# EAGLE design zasilacz (EAGLE 9.6.2)
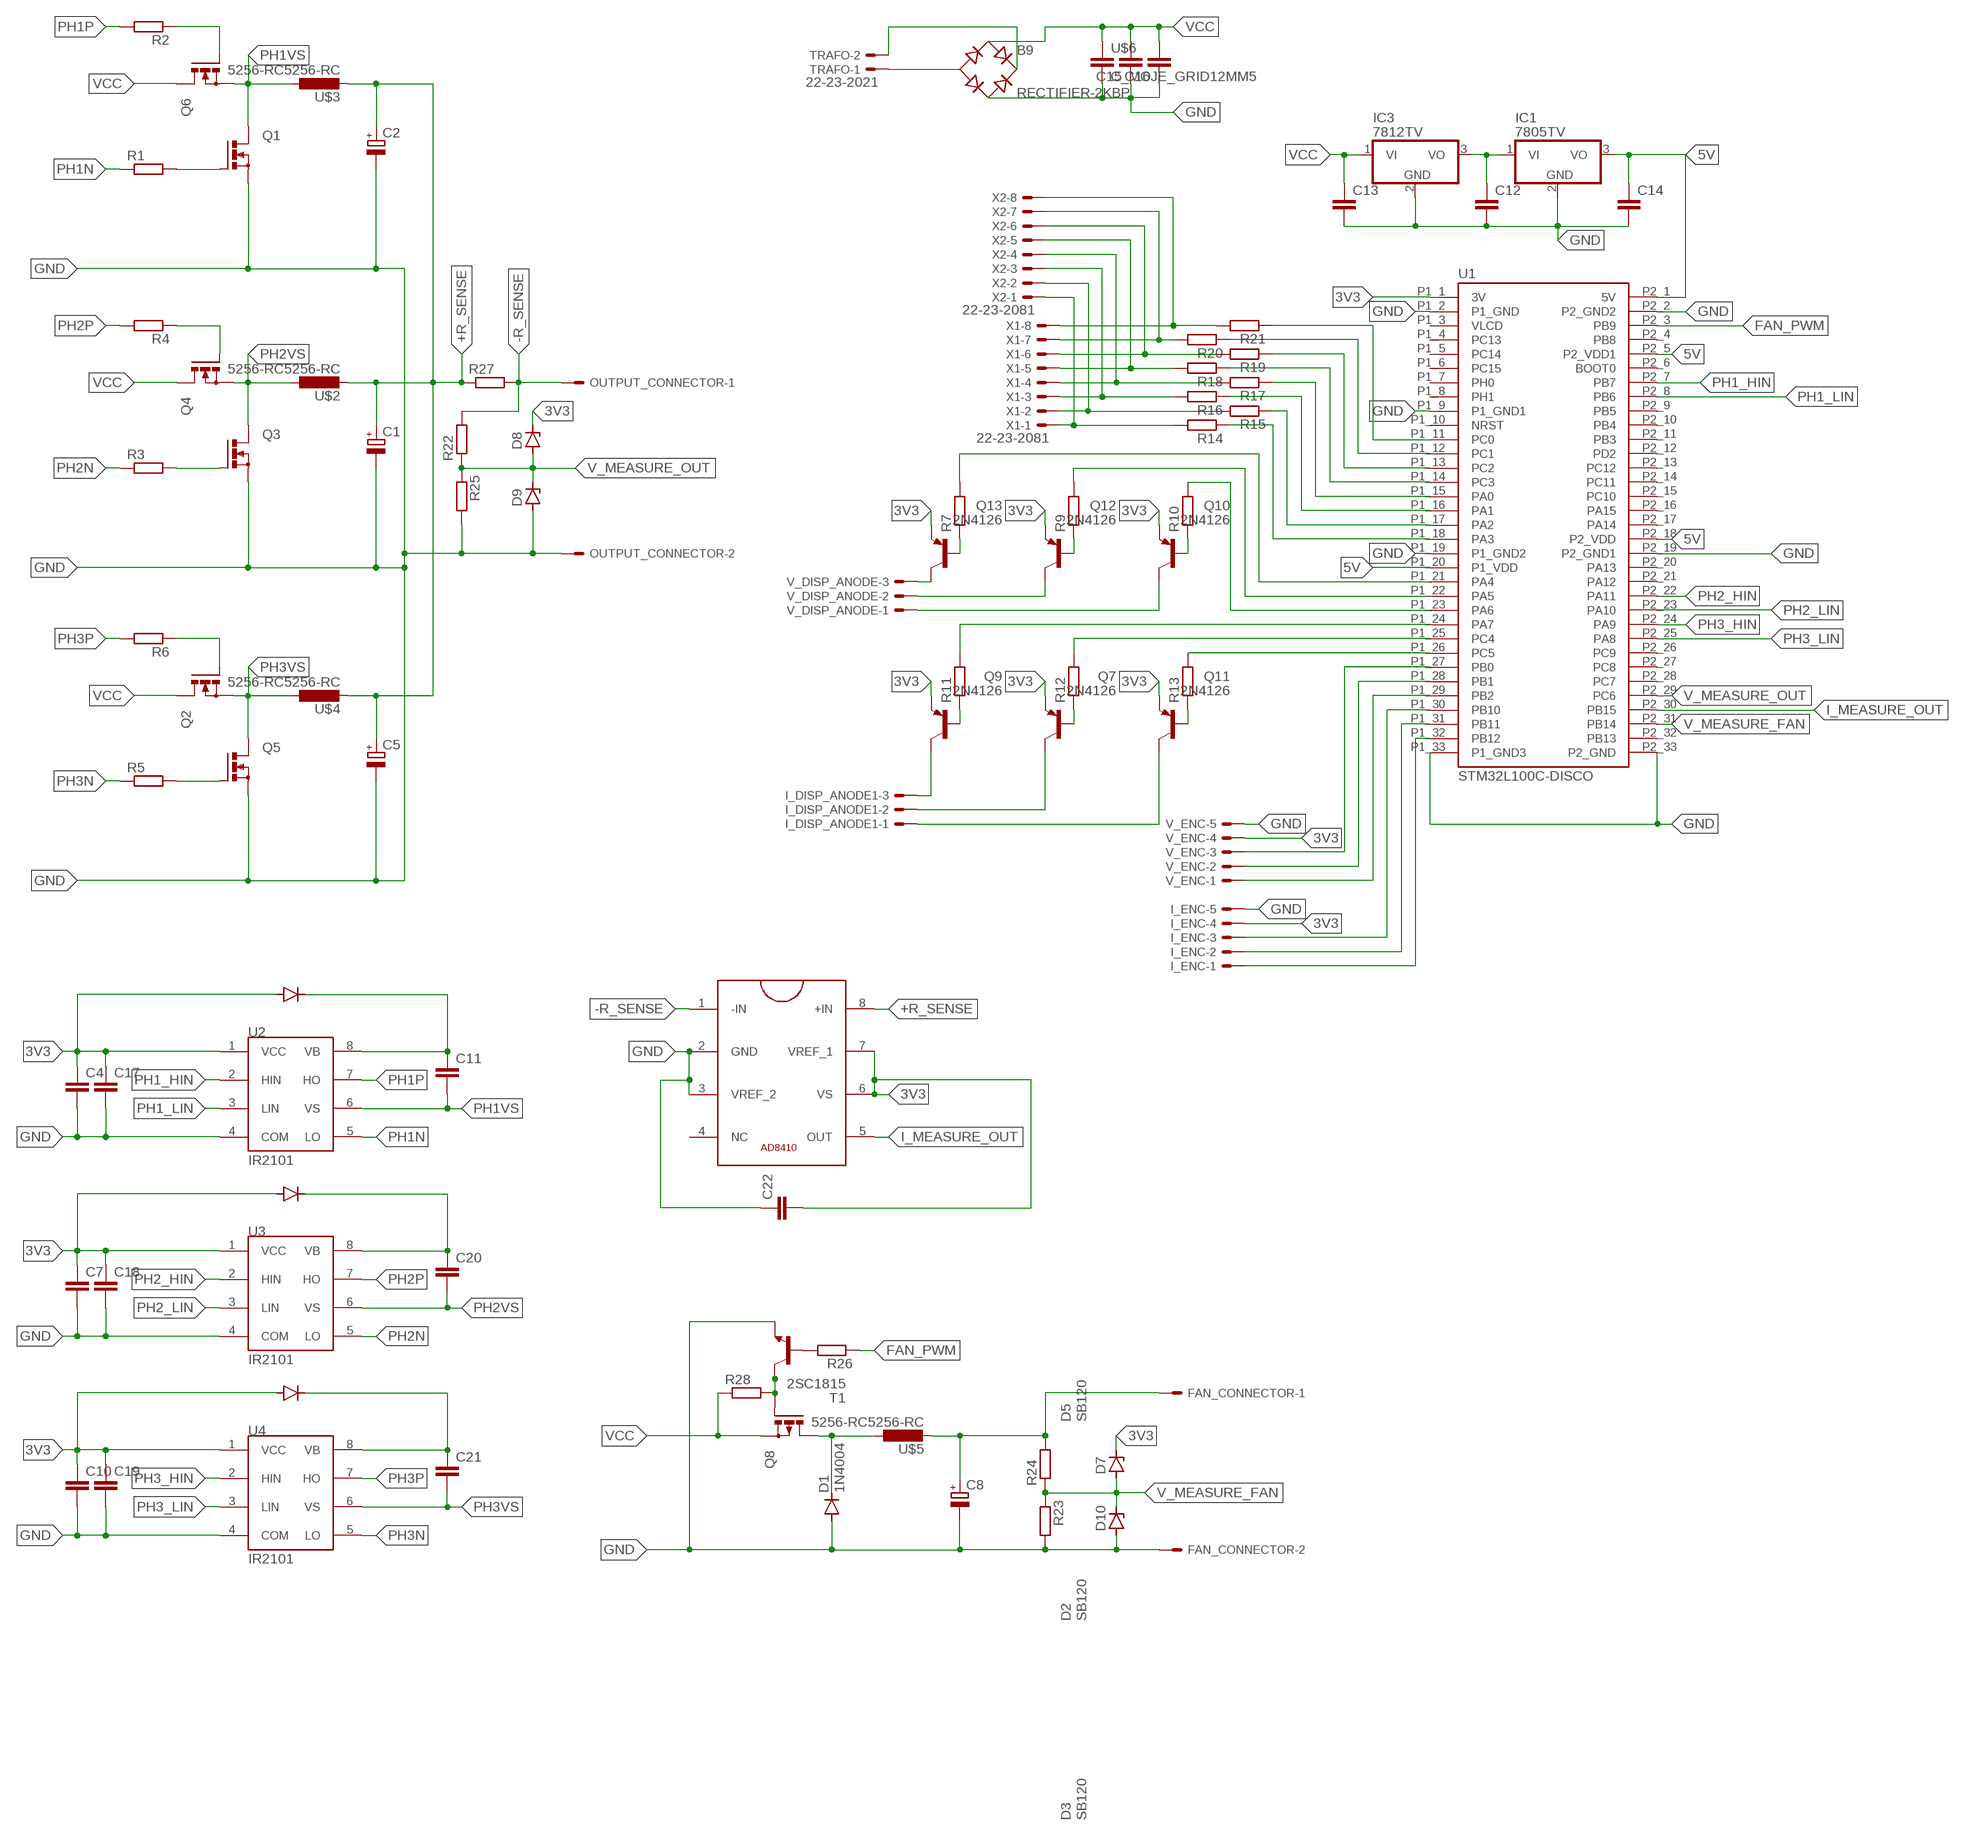
[diagram p0: schematic, sheet 1]

## Parts
B9  RECTIFIER-2KBP  [2KBP]
C1  CPOL-EUE5-13  [E5-13]
C2  CPOL-EUE5-13  [E5-13]
C4  C-EU025-024X044  [C025-024X044]
C5  CPOL-EUE5-13  [E5-13]
C7  C-EU025-024X044  [C025-024X044]
C8  CPOL-EUE5-13  [E5-13]
C10  C-EU025-024X044  [C025-024X044]
C11  C-EUC0603K  [C0603K]
C12  C-EU025-024X044  [C025-024X044]
C13  C-EU025-024X044  [C025-024X044]
C14  C-EU025-024X044  [C025-024X044]
C15  C-EU025-024X044  [C025-024X044]
C16  C-EU025-024X044  [C025-024X044]
C17  C-EU025-024X044  [C025-024X044]
C18  C-EU025-024X044  [C025-024X044]
C19  C-EU025-024X044  [C025-024X044]
C20  C-EUC0603K  [C0603K]
C21  C-EUC0603K  [C0603K]
C22  C-EU025-024X044  [C025-024X044]
D1  1N4004  [DO41-10]
D2  SB120  [DO41-10]
D3  SB120  [DO41-10]
D5  SB120  [DO41-10]
D7  ZENER-DIODEDO34-7  [DO34Z7]
D8  ZENER-DIODEDO34-7  [DO34Z7]
D9  ZENER-DIODEDO34-7  [DO34Z7]
D10  ZENER-DIODEDO34-7  [DO34Z7]
FAN_CONNECTOR  22-23-2021  [22-23-2021]
I_DISP_ANODE1  22-23-2031  [22-23-2031]
I_ENC  22-23-2051  [22-23-2051]
IC1  7805TV  [TO220V]
IC3  7812TV  [TO220V]
OUTPUT_CONNECTOR  22-23-2021  [22-23-2021]
Q1  PMOSFET_NTO220BV  [TO220BV]
Q2  PMOSFET_NTO220BV  [TO220BV]
Q3  PMOSFET_NTO220BV  [TO220BV]
Q4  PMOSFET_NTO220BV  [TO220BV]
Q5  PMOSFET_NTO220BV  [TO220BV]
Q6  PMOSFET_NTO220BV  [TO220BV]
Q7  2N4126  [TO92-CBE]
Q8  PMOSFET_PTO220BV  [TO220BV]
Q9  2N4126  [TO92-CBE]
Q10  2N4126  [TO92-CBE]
Q11  2N4126  [TO92-CBE]
Q12  2N4126  [TO92-CBE]
Q13  2N4126  [TO92-CBE]
R1  R-EU_0309/10  [0309/10]
R2  R-EU_0309/10  [0309/10]
R3  R-EU_0309/10  [0309/10]
R4  R-EU_0309/10  [0309/10]
R5  R-EU_0309/10  [0309/10]
R6  R-EU_0309/10  [0309/10]
R7  R-EU_0309/10  [0309/10]
R9  R-EU_0309/10  [0309/10]
R10  R-EU_0309/10  [0309/10]
R11  R-EU_0309/10  [0309/10]
R12  R-EU_0309/10  [0309/10]
R13  R-EU_0309/10  [0309/10]
R14  R-EU_0309/10  [0309/10]
R15  R-EU_0309/10  [0309/10]
R16  R-EU_0309/10  [0309/10]
R17  R-EU_0309/10  [0309/10]
R18  R-EU_0309/10  [0309/10]
R19  R-EU_0309/10  [0309/10]
R20  R-EU_0309/10  [0309/10]
R21  R-EU_0309/10  [0309/10]
R22  R-EU_0207/12  [0207/12]
R23  R-EU_0309/10  [0309/10]
R24  R-EU_0207/12  [0207/12]
R25  R-EU_0309/10  [0309/10]
R26  R-EU_0309/10  [0309/10]
R27  R-EU_R2512  [R2512]
R28  R-EU_0207/10  [0207/10]
T1  2SC1815  [TO92-ECB]
TRAFO  22-23-2021  [22-23-2021]
U1  STM32L100C-DISCO  [DEV_STM32L100C-DISCO]
U2  IR2101  [DIL08]
U3  IR2101  [DIL08]
U4  IR2101  [DIL08]
U$1  AD8410AD8410_V1  [AD8410]
U$2  5256-RC5256-RC  [INDAD4030W90L3300D1350B]
U$3  5256-RC5256-RC  [INDAD4030W90L3300D1350B]
U$4  5256-RC5256-RC  [INDAD4030W90L3300D1350B]
U$5  5256-RC5256-RC  [INDAD4030W90L3300D1350B]
U$6  C_MOJE_GRID12MM5  [C025-030X050]
V_DISP_ANODE  22-23-2031  [22-23-2031]
V_ENC  22-23-2051  [22-23-2051]
X1  22-23-2081  [22-23-2081]
X2  22-23-2081  [22-23-2081]

## Nets
3V3: C4.1 C7.1 C10.1 C17.1 C18.1 C19.1 D2.A D3.A D5.A D7.C D8.C I_ENC.4 Q7.E Q9.E Q10.E Q11.E Q12.E Q13.E U1.P1_1(3V) U2.1(VCC) U3.1(VCC) U4.1(VCC) V_ENC.4
5V: C14.1 IC1.3(VO) U1.P1_20(P1_VDD) U1.P2_1(5V) U1.P2_5(P2_VDD1) U1.P2_18(P2_VDD)
+R_SENSE: C1.+ C2.+ C5.+ R27.1 U$1.8(+IN) U$2.2 U$3.2 U$4.2
-R_SENSE: OUTPUT_CONNECTOR.1 R22.2 R27.2 U$1.1(-IN)
FAN_PWM: R26.1 U1.P2_3(PB9)
GND: B9.AC2 C1.- C2.- C4.2 C5.- C7.2 C8.- C10.2 C12.2 C13.2 C14.2 C15.1 C16.1 C17.2 C18.2 C19.2 C22.1 D1.A D9.A D10.A FAN_CONNECTOR.2 I_ENC.5 IC1.2(GND) IC3.2(GND) OUTPUT_CONNECTOR.2 Q1.S Q3.S Q5.S R23.2 R25.2 T1.E U1.P1_2(P1_GND) U1.P1_9(P1_GND1) U1.P1_19(P1_GND2) U1.P1_33(P1_GND3) U1.P2_2(P2_GND2) U1.P2_19(P2_GND1) U1.P2_33(P2_GND) U2.4(COM) U3.4(COM) U4.4(COM) U$1.2(GND) U$1.3(VREF_2) U$6.2 V_ENC.5
I_MEASURE_OUT: U1.P2_30(PB15) U$1.5(OUT)
N$1: Q8.G R28.2 T1.C
N$2: R26.2 T1.B
N$3: Q3.G R3.2
N$4: Q4.G R4.1
N$5: R14.1 U1.P1_18(PA3)
N$7: R15.1 U1.P1_17(PA2)
N$8: Q1.G R1.2
N$9: C22.2 U$1.6(VS) U$1.7(VREF_1)
N$10: C12.1 IC1.1(VI) IC3.3(VO)
N$11: Q6.G R2.1
N$14: R16.1 U1.P1_16(PA1)
N$16: R17.1 U1.P1_15(PA0)
N$17: R18.1 U1.P1_14(PC3)
N$18: Q5.G R5.2
N$19: Q2.G R6.1
N$20: R19.1 U1.P1_13(PC2)
N$21: Q13.C V_DISP_ANODE.3
N$22: R20.1 U1.P1_12(PC1)
N$23: B9.+ TRAFO.2
N$24: Q10.B R10.1
N$25: R21.1 U1.P1_11(PC0)
N$26: Q12.B R9.1
N$27: B9.- TRAFO.1
N$28: I_ENC.1 U1.P1_32(PB12)
N$29: D1.C Q8.D U$5.1
N$30: Q13.B R7.1
N$32: Q12.C V_DISP_ANODE.2
N$37: Q10.C V_DISP_ANODE.1
N$41: Q11.B R13.1
N$42: I_DISP_ANODE1.3 Q9.C
N$43: I_DISP_ANODE1.2 Q7.C
N$44: I_DISP_ANODE1.1 Q11.C
N$45: Q7.B R12.1
N$46: Q9.B R11.1
N$47: R14.2 X1.1 X2.1
N$48: R15.2 X1.2 X2.2
N$49: R16.2 X1.3 X2.3
N$50: R17.2 X1.4 X2.4
N$51: R18.2 X1.5 X2.5
N$52: R19.2 X1.6 X2.6
N$53: R20.2 X1.7 X2.7
N$54: R21.2 X1.8 X2.8
N$55: I_ENC.2 U1.P1_31(PB11)
N$56: I_ENC.3 U1.P1_30(PB10)
N$57: U1.P1_29(PB2) V_ENC.1
N$58: U1.P1_28(PB1) V_ENC.2
N$59: U1.P1_27(PB0) V_ENC.3
N$62: R13.2 U1.P1_26(PC5)
N$63: R12.2 U1.P1_25(PC4)
N$64: R11.2 U1.P1_24(PA7)
N$65: R10.2 U1.P1_23(PA6)
N$66: R9.2 U1.P1_22(PA5)
N$67: R7.2 U1.P1_21(PA4)
PH1_HIN: U1.P2_7(PB7) U2.2(HIN)
PH1_LIN: U1.P2_8(PB6) U2.3(LIN)
PH1N: R1.1 U2.5(LO)
PH1P: R2.2 U2.7(HO)
PH1VS: C11.2 Q1.D Q6.S U2.6(VS) U$3.1
PH2_HIN: U1.P2_22(PA11) U3.2(HIN)
PH2_LIN: U1.P2_23(PA10) U3.3(LIN)
PH2N: R3.1 U3.5(LO)
PH2P: R4.2 U3.7(HO)
PH2VS: C20.2 Q3.D Q4.S U3.6(VS) U$2.1
PH3_HIN: U1.P2_24(PA9) U4.2(HIN)
PH3_LIN: U1.P2_25(PA8) U4.3(LIN)
PH3N: R5.1 U4.5(LO)
PH3P: R6.2 U4.7(HO)
PH3VS: C21.2 Q2.S Q5.D U4.6(VS) U$4.1
UWY: C8.+ FAN_CONNECTOR.1 R24.2 U$5.2
V_MEASURE_FAN: D7.A D10.C R23.1 R24.1 U1.P2_31(PB14)
V_MEASURE_OUT: D8.A D9.C R22.1 R25.1 U1.P2_29(PC6)
VB: C11.1 C20.1 C21.1 D2.C D3.C D5.C U2.8(VB) U3.8(VB) U4.8(VB)
VCC: B9.AC1 C13.1 C15.2 C16.2 IC3.1(VI) Q2.D Q4.D Q6.D Q8.S R28.1 U$6.1
Unconnected: U1.P1_4(PC13) U1.P1_5(PC14) U1.P1_6(PC15) U1.P1_7(PH0) U1.P1_8(PH1) U1.P1_10(NRST) U1.P2_4(PB8) U1.P2_6(BOOT0) U1.P2_9(PB5) U1.P2_10(PB4) U1.P2_11(PB3) U1.P2_12(PD2) U1.P2_13(PC12) U1.P2_14(PC11) U1.P2_15(PC10) U1.P2_16(PA15) U1.P2_17(PA14) U1.P2_20(PA13) U1.P2_21(PA12) U1.P2_26(PC9) U1.P2_27(PC8) U1.P2_28(PC7) U1.P2_32(PB13) U$1.4(NC)

## Power pins joined to a net without a drawn wire
VLCD: U1.P1_3(VLCD)

## Library data of the parts
B9 = rectifier:RECTIFIER-: Rectifier
C1 C2 C5 C8 = rcl:CPOL-EU: POLARIZED CAPACITOR, European symbol; SPICEPREFIX: C
C4 C7 C10-C22 = rcl:C-EU: CAPACITOR, European symbol; SPICEPREFIX: C
D1 = diode:1N4004: DIODE general purpose rectifier, 1 A
D2 D3 D5 = diode:SB120: DIODE barrier rectifier, 1 A (Fairchild)
D7-D10 = diode:ZENER-DIODE: Z-Diode
FAN_CONNECTOR OUTPUT_CONNECTOR TRAFO = con-molex:22-23-2021: .100" (2.54mm) Center Header - 2 Pin; MF: MOLEX; MPN: 22-23-2021; OC_FARNELL: 1462926; OC_NEWARK: 25C3832
I_DISP_ANODE1 V_DISP_ANODE = con-molex:22-23-2031: .100" (2.54mm) Center Header - 3 Pin; MF: MOLEX; MPN: 22-23-2031; OC_FARNELL: 1462950; OC_NEWARK: 30C0862
I_ENC V_ENC = con-molex:22-23-2051: .100" (2.54mm) Center Header - 5 Pin; MF: MOLEX; MPN: 22-23-2051; OC_FARNELL: 1462952; OC_NEWARK: 38C9178
IC1 IC3 = linear:78*: Positive VOLTAGE REGULATOR Source: http://cache.national.com/ds/LM/LM78L05.pdf http://www.fairchildsemi.com/ds/LM/LM7805.pdf
Q1-Q6 = transistor-power:PMOSFET_N: Power MOSFET N-Channel
Q7 Q9-Q13 = transistor-pnp:2N4126*: PNP Transistror
Q8 = transistor-power:PMOSFET_P: Power MOSFET P-Channel
R1-R7 R9-R28 = rcl:R-EU_: RESISTOR, European symbol; SPICEPREFIX: R
T1 = transistor:2SC1815: NPN EPITAXIAL TRANSISTOR Source: TOSHIBA .. 2SC1815 1.pdf
U1 = STM32L100C-DISCO:STM32L100C-DISCO: STM32L100RCT6 Microcontroller Discovery Kit 16KB RAM 256KB Flash Win 7/Win Vista/Win XP OS Check prices <https://pricing.snapeda.com/parts/STM32L100C-DISCO/STMicroelectronics/view-part?ref=eda>; AVAILABILITY: Bad; DESCRIPTION: STM32L100 Discovery STM32L1 ARM® Cortex®-M3 MCU 32-Bit Embedded Evaluation Board; MF: STMicroelectronics; MP: STM32L100C-DISCO; PACKAGE: SOIC-16 STMicroelectronics; PRICE: None; PURCHASE-URL: https://pricing.snapeda.com/search/part/STM32L100C-DISCO/?ref=eda
U2-U4 = IR2101:IR2101: High and low side driver Check prices <https://pricing.snapeda.com/parts/IR2101/Infineon/view-part?ref=eda>; AVAILABILITY: Bad; DESCRIPTION: Half-Bridge Gate Driver IC Non-Inverting 8-SOIC; MF: Infineon; MP: IR2101; PACKAGE: DIP-8 International Rectifier; PRICE: None
U$1 = AD8410:AD8410
U$2-U$5 = rcl:5256-RC
U$6 = rcl:C_MOJE_GRID12MM5
X1 X2 = con-molex:22-23-2081: .100" (2.54mm) Center Header - 8 Pin; MF: MOLEX; MPN: 22-23-2081; OC_FARNELL: 1756826; OC_NEWARK: 01C7592

## Net classes
0 default: width 0.787 mm, drill 0.787 mm, clearance 0.787 mm

## Board
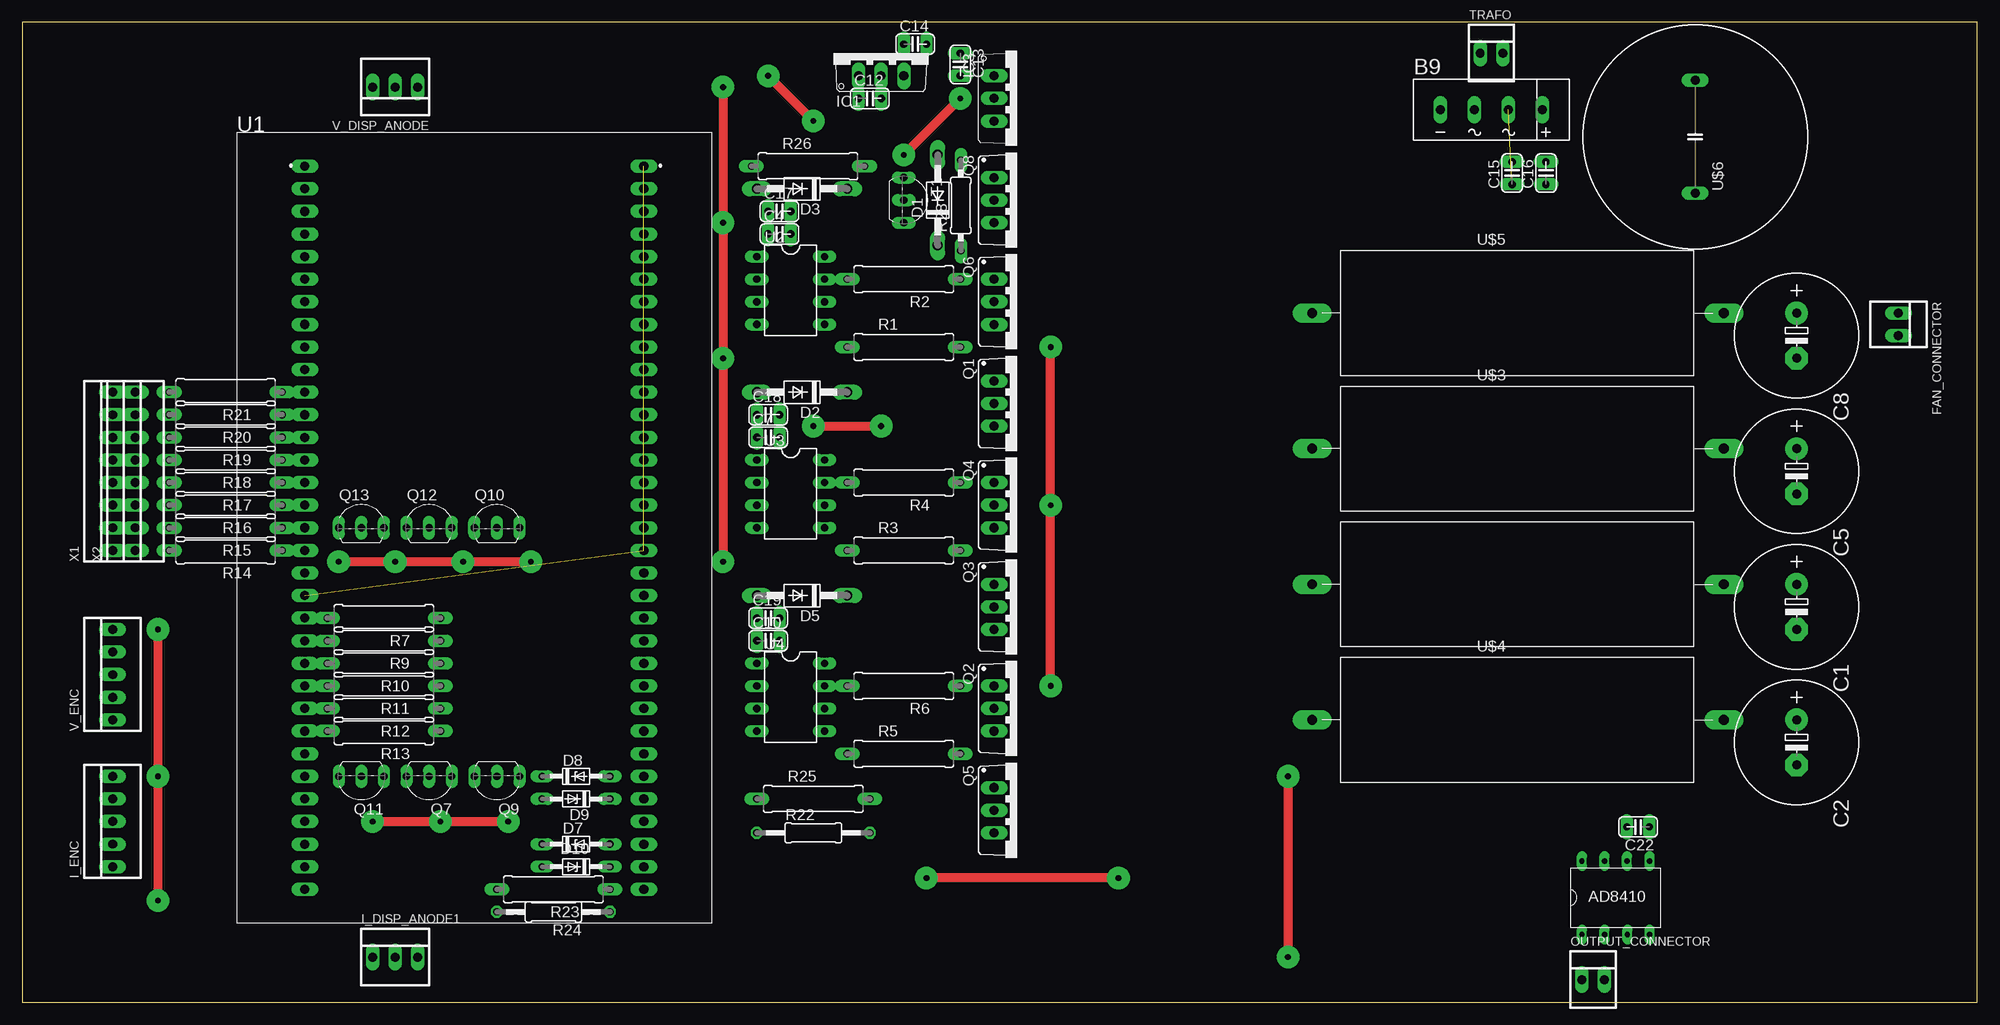
[diagram p1: board, top side]
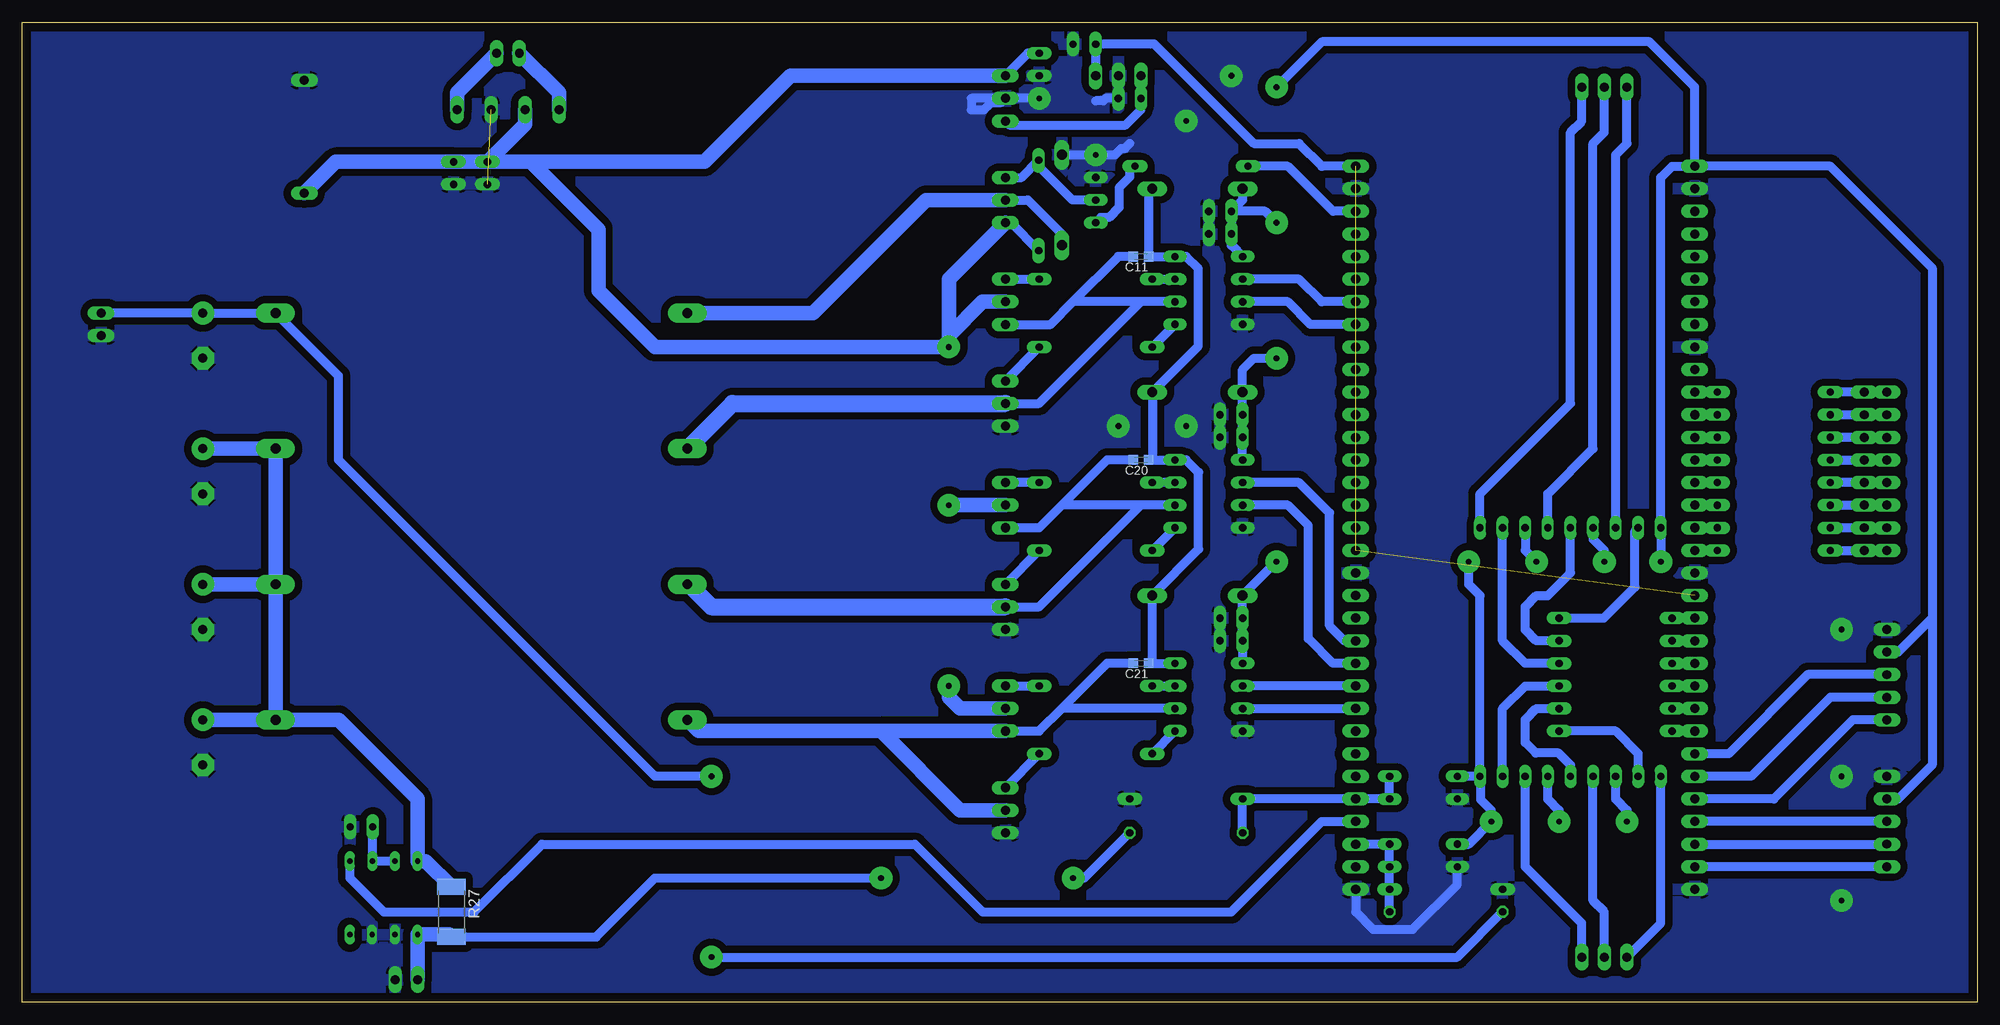
[diagram p2: board, bottom side, seen from below]

Size 219.69 x 110.16 mm. Coordinates in mm from the lower left corner, seen from the top.
Outline: 0,0 219.69,0 219.69,110.16 0,110.16 0,0
Copper layers (1*16): Top 0.035mm / dielectric 1.5mm / Bottom 0.035mm
Design rules "default": minimum track width 6mil, minimum drill 0.35mm, track to track 6mil, track to pad 6mil, pad to pad 6mil, via to via 6mil, smd to smd 6mil, copper to edge 40mil, drill to drill 6mil, minimum pad ring 10mil, minimum via ring 8mil, stop-mask expansion 4mil, vias tented up to drill 0mil, thermal gap 10mil

### Footprints (pad centres in the part's own frame; a part is rotated, then mirrored left to right if it is on the bottom)
2KBP = drill 1.016 long: + 5.715,0; - -5.715,0; AC1 -1.905,0; AC2 1.905,0
E5-13 = drill 1.016 pad 2.54: + -2.54,0 | drill 1.016 pad 2.54 octagon: - 2.54,0
C025-024X044 = drill 0.813 pad 1.422 long: 1 -1.27,0; 2 1.27,0
C0603K = smd 1.05 x 1.08: 1 -0.875,0; 2 0.875,0
DO41-10 = drill 1.118 long: A 5.08,0; C -5.08,0
DO34Z7 = drill 0.813 long: A 3.81,0; C -3.81,0
22-23-2021 = drill 1 long: 1 -1.27,0; 2 1.27,0
22-23-2031 = drill 1 long: 1 -2.54,0; 2 0,0; 3 2.54,0
22-23-2051 = drill 1 long: 1 -5.08,0; 2 -2.54,0; 3 0,0; 4 2.54,0; 5 5.08,0
TO220V = drill 1.016 long: 1 -2.54,-2.54; 2 0,-2.54; 3 2.54,-2.54
TO220BV = drill 1.016 long: D 0,-2.54; G -2.54,-2.54; S 2.54,-2.54
TO92-CBE = drill 0.813 long: B 0,0; C 2.54,0; E -2.54,0
0309/10 = drill 0.813 pad 1.422 long: 1 -7.62,0; 2 5.08,0
0207/12 = drill 0.813 octagon: 1 -6.35,0; 2 6.35,0
R2512 = smd 1.8 x 3.2: 1 -2.8,0; 2 2.8,0
0207/10 = drill 0.813 pad 1.422 long: 1 -5.08,0; 2 5.08,0
TO92-ECB = drill 0.813 long: B 2.54,0; C 0,0; E -2.54,0
DEV_STM32L100C-DISCO = drill 1.02 long: P1_1 -19.05,40.64; P1_2 -19.05,38.1; P1_3 -19.05,35.56; P1_4 -19.05,33.02; P1_5 -19.05,30.48; P1_6 -19.05,27.94; P1_7 -19.05,25.4; P1_8 -19.05,22.86; P1_9 -19.05,20.32; P1_10 -19.05,17.78; P1_11 -19.05,15.24; P1_12 -19.05,12.7; P1_13 -19.05,10.16; P1_14 -19.05,7.62; P1_15 -19.05,5.08; P1_16 -19.05,2.54; P1_17 -19.05,0; P1_18 -19.05,-2.54; P1_19 -19.05,-5.08; P1_20 -19.05,-7.62; P1_21 -19.05,-10.16; P1_22 -19.05,-12.7; P1_23 -19.05,-15.24; P1_24 -19.05,-17.78; P1_25 -19.05,-20.32; P1_26 -19.05,-22.86; P1_27 -19.05,-25.4; P1_28 -19.05,-27.94; P1_29 -19.05,-30.48; P1_30 -19.05,-33.02; P1_31 -19.05,-35.56; P1_32 -19.05,-38.1; P1_33 -19.05,-40.64; P2_1 19.05,40.64; P2_2 19.05,38.1; P2_3 19.05,35.56; P2_4 19.05,33.02; P2_5 19.05,30.48; P2_6 19.05,27.94; P2_7 19.05,25.4; P2_8 19.05,22.86; P2_9 19.05,20.32; P2_10 19.05,17.78; P2_11 19.05,15.24; P2_12 19.05,12.7; P2_13 19.05,10.16; P2_14 19.05,7.62; P2_15 19.05,5.08; P2_16 19.05,2.54; P2_17 19.05,0; P2_18 19.05,-2.54; P2_19 19.05,-5.08; P2_20 19.05,-7.62; P2_21 19.05,-10.16; P2_22 19.05,-12.7; P2_23 19.05,-15.24; P2_24 19.05,-17.78; P2_25 19.05,-20.32; P2_26 19.05,-22.86; P2_27 19.05,-25.4; P2_28 19.05,-27.94; P2_29 19.05,-30.48; P2_30 19.05,-33.02; P2_31 19.05,-35.56; P2_32 19.05,-38.1; P2_33 19.05,-40.64
DIL08 = drill 0.813 long: 1 -3.81,-3.81; 2 -1.27,-3.81; 3 1.27,-3.81; 4 3.81,-3.81; 5 3.81,3.81; 6 1.27,3.81; 7 -1.27,3.81; 8 -3.81,3.81
AD8410 = drill 0.6 long: 1 1.27,-0.83; 2 3.81,-0.83; 3 6.38,-0.83; 4 8.89,-0.83; 5 8.89,7.43; 6 6.35,7.43; 7 3.81,7.43; 8 1.27,7.43
INDAD4030W90L3300D1350B = drill 1.1 pad 2.184 long: 1 -20.15,0; 2 26.119,0
C025-030X050 = drill 1.016 long: 1 1.27,0; 2 -11.43,0
22-23-2081 = drill 1 long: 1 -8.89,0; 2 -6.35,0; 3 -3.81,0; 4 -1.27,0; 5 1.27,0; 6 3.81,0; 7 6.35,0; 8 8.89,0

### Placement (x,y rotation side)
B9  165.1,100.33 0 top
C1  199.39,44.45 270 top
C2  199.39,29.21 270 top
C4  85.09,86.36 0 top
C5  199.39,59.69 270 top
C7  83.82,63.5 0 top
C8  199.39,74.93 270 top
C10  83.82,40.64 0 top
C11  93.98,83.82 180 bottom
C12  95.25,101.6 0 top
C13  105.41,105.41 270 top
C14  100.34,107.7 0 top
C15  167.42,93.2 90 top
C16  171.23,93.2 90 top
C17  85.09,88.9 0 top
C18  83.82,66.04 0 top
C19  83.82,43.18 0 top
C20  93.98,60.96 180 bottom
C21  93.98,38.1 180 bottom
C22  181.58,19.72 180 top
D1  102.87,90.17 90 top
D2  87.63,68.58 180 top
D3  87.63,91.44 180 top
D5  87.63,45.72 180 top
D7  62.23,17.78 0 top
D8  62.23,25.4 0 top
D9  62.23,22.86 180 top
D10  62.23,15.24 180 top
FAN_CONNECTOR  210.82,76.2 270 top
I_DISP_ANODE1  41.91,5.08 0 top
I_ENC  10.16,20.32 90 top
IC1  96.52,106.68 0 top
IC3  111.76,101.6 270 top
OUTPUT_CONNECTOR  176.53,2.54 0 top
Q1  111.76,67.31 270 top
Q2  111.76,33.02 270 top
Q3  111.76,44.45 270 top
Q4  111.76,55.88 270 top
Q5  111.76,21.59 270 top
Q6  111.76,78.74 270 top
Q7  45.72,25.4 180 top
Q8  111.76,90.17 270 top
Q9  53.34,25.4 180 top
Q10  53.34,53.34 0 top
Q11  38.1,25.4 180 top
Q12  45.72,53.34 0 top
Q13  38.1,53.34 0 top
R1  100.33,73.66 0 top
R2  97.79,81.28 180 top
R3  100.33,50.8 0 top
R4  97.79,58.42 180 top
R5  100.33,27.94 0 top
R6  97.79,35.56 180 top
R7  39.37,43.18 180 top
R9  39.37,40.64 180 top
R10  39.37,38.1 180 top
R11  39.37,35.56 180 top
R12  39.37,33.02 180 top
R13  39.37,30.48 180 top
R14  21.59,50.8 180 top
R15  21.59,53.34 180 top
R16  21.59,55.88 180 top
R17  21.59,58.42 180 top
R18  21.59,60.96 180 top
R19  21.59,63.5 180 top
R20  21.59,66.04 180 top
R21  21.59,68.58 180 top
R22  88.9,19.05 0 top
R23  58.42,12.7 180 top
R24  59.69,10.16 180 top
R25  90.17,22.86 0 top
R26  89.57,93.98 0 top
R27  171.45,10.16 270 bottom
R28  105.47,89.57 90 top
T1  99.06,90.17 270 top
TRAFO  165.1,106.68 0 top
U1  50.8,53.34 0 top
U2  86.36,80.01 270 top
U3  86.36,57.15 270 top
U4  86.36,34.29 270 top
U$1  173.99,8.44 0 top
U$2  165.1,46.99 0 top
U$3  165.1,62.23 0 top
U$4  165.1,31.75 0 top
U$5  165.1,77.47 0 top
U$6  188,92.2 270 top
V_DISP_ANODE  41.91,102.87 180 top
V_ENC  10.16,36.83 90 top
X1  10.16,59.69 90 top
X2  12.7,59.69 90 top

### Tracks (layer width: path | path; a pad name or v marks a point on that pad's centre or on a via)
3V3  (via drill 0.65 pad 2.54)
  Top 1.016: v57.15,49.53 v49.53,49.53 v41.91,49.53 v35.56,49.53 | v39.37,20.32 v46.99,20.32 v54.61,20.32 | v78.74,102.87 v78.74,87.63 v78.74,72.39 v78.74,49.53
  Bottom 1.016: V_ENC.4 8.89,39.37 5.08,43.18 | U1.P1_1 16.51,93.98 5.08,82.55 5.08,43.18 | 5.08,43.18 5.08,26.67 8.89,22.86 I_ENC.4 | U1.P1_1 34.29,93.98 35.56,92.71 Q13.E v35.56,49.53 | D3.A 82.55,90.17 C17.1 | C17.1 C4.1 83.82,85.09 U2.1 | Q9.E D8.C | U4.1 C10.1 C19.1 D5.A v78.74,49.53 | U3.1 C7.1 C18.1 D2.A 82.55,71.12 81.28,72.39 v78.74,72.39 | Q12.E 43.18,52.07 41.91,50.8 v41.91,49.53 | Q10.E 50.8,50.8 v49.53,49.53 | Q9.E 55.88,45.72 57.15,46.99 v57.15,49.53 | v46.99,20.32 46.99,21.59 48.26,22.86 Q7.E | v39.37,20.32 39.37,21.59 40.64,22.86 Q11.E | Q9.E 55.8,25.32 55.8,22.78 54.61,21.59 v54.61,20.32 57.15,17.78 D7.C | U1.P1_1 31.75,102.87 36.83,107.95 73.66,107.95 v78.74,102.87 | v78.74,87.63 80.01,88.9 C17.1
5V  (3 unrouted)
  Bottom 1.016: IC1.3 C14.1 92.46,107.7 81.28,96.52 76.2,96.52 73.66,93.98 U1.P2_1
+R_SENSE
  Bottom 1.651: C5.+ U$3.2 U$2.2 | U$2.2 C1.+ | U$4.2 C2.+ | U$4.2 U$2.2 | U$4.2 184.15,31.75 175.26,22.86 U$1.8 174.36,15.87 R27.1
-R_SENSE  (via drill 0.65 pad 2.54)
  Top 1.016: v123.19,13.97 v101.6,13.97
  Bottom 1.016: U$1.1 175.25,7.62 | 171.71,7.62 R27.2 155.2,7.36 148.59,13.97 v123.19,13.97 | v101.6,13.97 100.33,13.97 R22.2
  Bottom 1.651: OUTPUT_CONNECTOR.1 U$1.1 | 175.25,7.62 171.71,7.62
FAN_PWM
  Bottom 1.016: U1.P2_3 72.39,88.9 77.47,93.98 R26.1
GND  (via drill 0.65 pad 2.54)  (1 unrouted)
  Top 1.016: v15.24,11.43 v15.24,25.4 v15.24,41.91 | v83.82,104.14 v88.9,99.06 | v88.9,64.77 v96.52,64.77 | v99.06,95.25 v105.41,101.6
  Bottom 1.016: D1.A 96.92,95.25 96.19,95.99 95.77,95.99 95.25,96.52 | 99.06,101.32 98.21,101.32 97.93,101.6 C12.2 | v105.41,101.6 IC3.2 | IC3.2 113.03,101.6 113.03,100.33 111.62,100.33 110.83,101.12 109.7,101.12 IC3.2 | U1.P2_33 69.85,10.16 67.89,8.21 63.45,8.21 58.42,13.23 D10.A
  pour Bottom (isolate 0.813): 0,0 0,110.49 219.71,110.49 219.71,0
I_MEASURE_OUT
  Bottom 1.016: U1.P2_30 73.66,20.32 83.82,10.16 111.76,10.16 119.38,17.78 161.29,17.78 168.91,10.16 179.07,10.16 182.88,13.97 U$1.5
N$1
  Bottom 1.016: Q8.G 107.4,92.71 R28.2 105.47,93.99 101.65,90.17 T1.C
N$2
  Bottom 1.016: R26.2 95.25,93.38 95.25,92.76 96.44,91.56 96.44,89.36 97.59,88.21 98.48,88.21 T1.B
N$3
  Bottom 1.016: Q3.G R3.2
N$4
  Bottom 1.016: R4.1 Q4.G
N$5
  Bottom 1.016: R14.1 U1.P1_18
N$7
  Bottom 1.016: U1.P1_17 R15.1
N$8
  Bottom 1.016: Q1.G R1.2
N$9
  Bottom 1.016: C22.2 180.31,15.9 U$1.6 U$1.7
N$10
  Bottom 1.016: IC1.1 C12.1 93.98,100.33 95.7,98.61 108.77,98.61 IC3.3
N$11
  Bottom 1.016: Q6.G R2.1
N$14
  Bottom 1.016: R16.1 U1.P1_16
N$16
  Bottom 1.016: U1.P1_15 R17.1
N$17
  Bottom 1.016: R18.1 U1.P1_14
N$18
  Bottom 1.016: Q5.G R5.2
N$19
  Bottom 1.016: Q2.G R6.1
N$20
  Bottom 1.016: U1.P1_13 R19.1
N$21
  Bottom 1.016: Q13.C 40.64,95.25 39.37,96.52 V_DISP_ANODE.3
N$22
  Bottom 1.016: R20.1 U1.P1_12
N$23
  Bottom 1.651: B9.+ 170.81,102.23 TRAFO.2
N$24
  Bottom 1.016: R10.1 50.8,38.1 53.34,40.64 Q10.B
N$25
  Bottom 1.016: R21.1 U1.P1_11
N$26
  Bottom 1.016: R9.1 49.53,40.64 50.8,41.91 50.8,44.45 49.53,45.72 48.26,45.72 45.72,48.26 Q12.B
N$27
  Bottom 1.651: B9.- 159.38,102.23 TRAFO.1
N$28
  Bottom 1.016: I_ENC.1 U1.P1_32
N$29
  Bottom 1.016: Q8.D 106.68,90.17 102.87,86.36 D1.C
  Bottom 1.651: Q8.D 118.11,90.17 130.81,77.47 U$5.1
N$30
  Bottom 1.016: Q13.B 38.47,52.97 38.47,46.68 41.97,43.18 R7.1
N$32
  Bottom 1.016: Q12.C 48.26,57.15 43.18,62.23 43.18,96.52 41.91,97.79 V_DISP_ANODE.2
N$37
  Bottom 1.016: Q10.C 55.88,57.15 45.72,67.31 45.72,97.79 44.45,99.06 V_DISP_ANODE.1
N$41
  Bottom 1.016: Q11.B 38.1,27.94 40.64,30.48 R13.1
N$42
  Bottom 1.016: I_DISP_ANODE1.3 44.45,8.89 50.8,15.24 Q9.C
N$43
  Bottom 1.016: I_DISP_ANODE1.2 41.91,10.16 43.18,11.43 Q7.C
N$44
  Bottom 1.016: I_DISP_ANODE1.1 35.56,8.89 Q11.C
N$45
  Bottom 1.016: Q7.B 45.72,26.67 47.07,28.02 49.61,28.02 50.8,29.21 50.8,31.75 49.53,33.02 R12.1
N$46
  Bottom 1.016: Q9.B 53.34,33.02 50.8,35.56 R11.1
N$47
  Bottom 1.016: R14.2 X2.1 X1.1
N$48
  Bottom 1.016: X1.2 X2.2 R15.2
N$49
  Bottom 1.016: R16.2 X2.3 X1.3
N$50
  Bottom 1.016: X1.4 X2.4 R17.2
N$51
  Bottom 1.016: R18.2 X2.5 X1.5
N$52
  Bottom 1.016: X1.6 X2.6 R19.2
N$53
  Bottom 1.016: R20.2 X2.7 X1.7
N$54
  Bottom 1.016: X1.8 X2.8 R21.2
N$55
  Bottom 1.016: U1.P1_31 I_ENC.2
N$56
  Bottom 1.016: I_ENC.3 U1.P1_30
N$57
  Bottom 1.016: U1.P1_29 22.86,22.86 13.97,31.75 V_ENC.1
N$58
  Bottom 1.016: V_ENC.2 16.51,34.29 25.4,25.4 U1.P1_28
N$59
  Bottom 1.016: V_ENC.3 19.05,36.83 27.94,27.94 U1.P1_27
N$62
  Bottom 1.016: U1.P1_26 R13.2
N$63
  Bottom 1.016: R12.2 U1.P1_25
N$64
  Bottom 1.016: U1.P1_24 R11.2
N$65
  Bottom 1.016: R10.2 U1.P1_23
N$66
  Bottom 1.016: U1.P1_22 R9.2
N$67
  Bottom 1.016: U1.P1_21 R7.2
PH1_HIN
  Bottom 1.016: U2.2 76.2,81.28 73.66,78.74 U1.P2_7
PH1_LIN
  Bottom 1.016: U1.P2_8 74.93,76.2 77.47,78.74 U2.3
PH1N
  Bottom 1.016: U2.5 R1.1
PH1P
  Bottom 1.016: R2.2 U2.7
PH1VS
  Bottom 1.016: C11.2 96.52,83.82 101.6,78.74 | U2.6 93.98,78.74 | 93.98,78.74 101.6,78.74 | Q1.D 105.41,67.31 93.98,78.74 | Q6.S 104.14,76.2 101.6,78.74
  Bottom 1.905: U$3.1 139.87,67.31 Q1.D
PH2_HIN
  Bottom 1.016: U1.P2_22 71.12,40.64 72.8,42.32 72.8,55.02 76.2,58.42 U3.2
PH2_LIN
  Bottom 1.016: U1.P2_23 72.39,38.1 75.18,40.89 75.18,53.59 77.47,55.88 U3.3
PH2N
  Bottom 1.016: U3.5 R3.1
PH2P
  Bottom 1.016: U3.7 R4.2
PH2VS
  Bottom 1.016: U$2.1 144.78,46.99 | 102.87,55.88 97.79,60.96 C20.2 | U3.6 93.98,55.88 | 93.98,55.88 102.87,55.88 | 102.87,55.88 105.41,53.34 Q4.S | Q3.D 105.41,44.45 93.98,55.88
  Bottom 1.905: Q3.D 142.24,44.45 144.78,46.99
PH3_HIN
  Bottom 1.016: U1.P2_24 U4.2
PH3_LIN
  Bottom 1.016: U4.3 U1.P2_25
PH3N
  Bottom 1.016: U4.5 R5.1
PH3P
  Bottom 1.016: R6.2 U4.7
PH3VS
  Bottom 1.016: U4.6 102.87,33.02 | C21.2 97.79,38.1 102.87,33.02 | Q2.S 105.41,30.48 102.87,33.02
  Bottom 1.651: U$4.1 143.68,30.48 123.19,30.48 | 123.19,30.48 114.3,21.59 Q5.D | Q2.S 123.19,30.48
UWY  (via drill 0.65 pad 2.54)
  Top 1.016: v142.24,25.4 v142.24,5.08
  Bottom 1.016: FAN_CONNECTOR.1 C8.+ U$5.2 184.15,70.4 184.15,60.96 148.59,25.4 v142.24,25.4 | R24.2 58.42,5.08 v142.24,5.08
V_MEASURE_FAN
  Bottom 1.016: R24.1 R23.1 D10.C D7.A U1.P2_31
V_MEASURE_OUT
  Bottom 1.016: R22.1 R25.1 U1.P2_29 D9.C D8.A
VB
  Bottom 1.016: C20.1 93.03,60.96 | 93.03,60.96 U3.8 88.9,60.96 87.49,59.55 87.49,50.94 D5.C 92.71,38.49 C21.1 U4.8 | 93.03,60.96 93.03,61.03 92.71,61.35 D2.C 87.52,73.77 87.52,82.44 88.9,83.82 U2.8 C11.1 93.11,91.05 D3.C
VCC  (via drill 0.65 pad 2.54)
  Top 1.016: v115.57,35.56 v115.57,55.88 v115.57,73.66
  Bottom 1.016: C13.1 106.68,106.68 IC3.1 | R28.1 108.61,87.63 Q8.S
  Bottom 1.651: C15.2 C16.2 184.46,94.47 U$6.1 | IC3.1 133.35,104.14 143.02,94.47 162.56,94.47 | v115.57,73.66 115.57,74.93 111.76,78.74 Q6.D | v115.57,73.66 115.57,81.28 Q8.S | Q4.D v115.57,55.88 | v115.57,35.56 115.57,34.29 114.3,33.02 Q2.D | B9.AC1 163.19,98.7 C15.2 | C15.2 162.56,94.47 | v115.57,73.66 148.59,73.66 154.94,80.01 154.94,86.85 162.56,94.47